# EAGLE design batstack_mic (EAGLE 5.10)
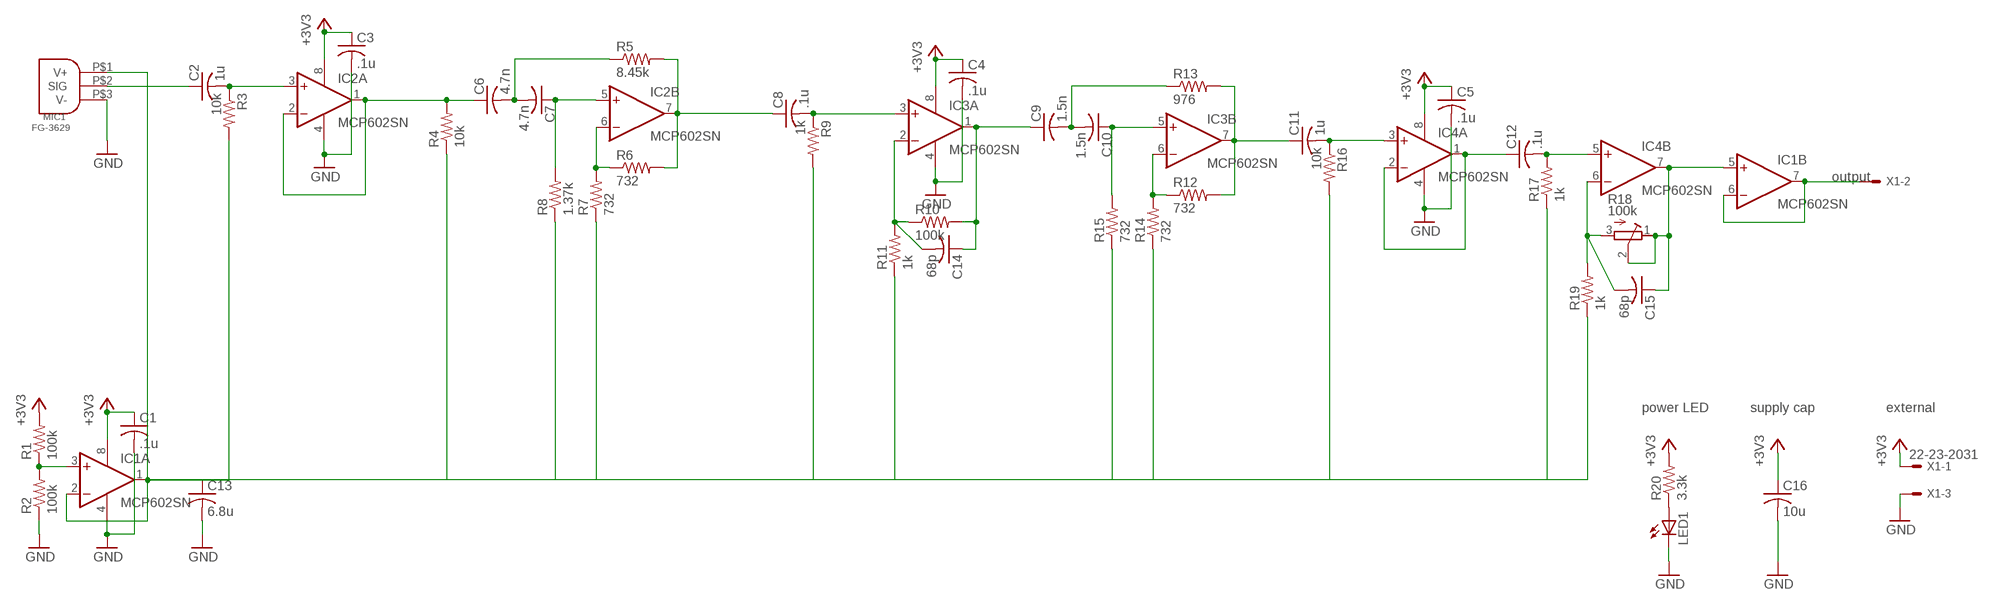
[diagram p0: schematic, sheet 1]

## Parts
C1  .1u  C-USC0603  [C0603]
C2  1u  C-USC0603  [C0603]
C3  .1u  C-USC0603  [C0603]
C4  .1u  C-USC0603  [C0603]
C5  .1u  C-USC0603  [C0603]
C6  4.7n  C-USC0603  [C0603]
C7  4.7n  C-USC0603  [C0603]
C8  .1u  C-USC0603  [C0603]
C9  1.5n  C-USC0603  [C0603]
C10  1.5n  C-USC0603  [C0603]
C11  1u  C-USC0603  [C0603]
C12  .1u  C-USC0603  [C0603]
C13  6.8u  C-USC0805  [C0805]
C14  68p  C-USC0603  [C0603]
C15  68p  C-USC0603  [C0603]
C16  10u  C-USC0805  [C0805]
IC1  MCP602SN  [SO08]
IC2  MCP602SN  [SO08]
IC3  MCP602SN  [SO08]
IC4  MCP602SN  [SO08]
LED1  LEDCHIP-LED0603  [CHIP-LED0603]
MIC1  FG-3629  [FG-3329]
R1  100k  R-US_R0603  [R0603]
R2  100k  R-US_R0603  [R0603]
R3  10k  R-US_R0603  [R0603]
R4  10k  R-US_R0603  [R0603]
R5  8.45k  R-US_R0603  [R0603]
R6  732  R-US_R0603  [R0603]
R7  732  R-US_R0603  [R0603]
R8  1.37k  R-US_R0603  [R0603]
R9  1k  R-US_R0603  [R0603]
R10  100k  R-US_R0603  [R0603]
R11  1k  R-US_R0603  [R0603]
R12  732  R-US_R0603  [R0603]
R13  976  R-US_R0603  [R0603]
R14  732  R-US_R0603  [R0603]
R15  732  R-US_R0603  [R0603]
R16  10k  R-US_R0603  [R0603]
R17  1k  R-US_R0603  [R0603]
R18  100k  R-TRIMMT93YB  [RTRIMT93YB]
R19  1k  R-US_R0603  [R0603]
R20  3.3k  R-US_R0603  [R0603]
X1  22-23-2031  [22-23-2031]

## Nets
+3V3: C1.1 C3.1 C4.1 C5.1 C16.1 IC1.8(P:V+) IC2.8(P:V+) IC3.8(P:V+) IC4.8(P:V+) R1.2 R20.2 X1.1
GND: C1.2 C3.2 C4.2 C5.2 C13.2 C16.2 IC1.4(P:V-) IC2.4(P:V-) IC3.4(P:V-) IC4.4(P:V-) LED1.C MIC1.P$3(V-) R2.1 X1.3
N$1: C2.1 MIC1.P$2(SIG)
N$2: IC1.3(A:+IN) R1.1 R2.2
N$3: C2.2 IC2.3(A:+IN) R3.1
N$4: C6.2 C7.2 R5.1
N$5: C8.2 IC3.3(A:+IN) R9.1
N$6: C6.1 IC2.1(A:OUT) IC2.2(A:-IN) R4.2
N$7: IC2.6(B:-IN) R6.1 R7.2
N$8: C7.1 IC2.5(B:+IN) R8.2
N$9: C8.1 IC2.7(B:OUT) R5.2 R6.2
N$10: C9.1 C14.1 IC3.1(A:OUT) R10.2
N$11: C14.2 IC3.2(A:-IN) R10.1 R11.2
N$12: C9.2 C10.2 R13.1
N$13: C10.1 IC3.5(B:+IN) R15.2
N$14: C11.1 IC3.7(B:OUT) R12.2 R13.2
N$15: IC3.6(B:-IN) R12.1 R14.2
N$16: C11.2 IC4.3(A:+IN) R16.1
N$17: C12.1 IC4.1(A:OUT) IC4.2(A:-IN)
N$18: C12.2 IC4.5(B:+IN) R17.2
N$20: IC1.6(B:-IN) IC1.7(B:OUT) X1.2
N$21: C15.2 IC4.6(B:-IN) R18.3(E) R19.2
N$22: LED1.A R20.1
N$23: C15.1 IC1.5(B:+IN) IC4.7(B:OUT) R18.1(A) R18.2(S)
V_OFFSET: C13.1 IC1.1(A:OUT) IC1.2(A:-IN) MIC1.P$1(V+) R3.2 R4.1 R7.1 R8.1 R9.2 R11.1 R14.1 R15.1 R16.2 R17.1 R19.1

## Notes on the sheet
- output
- power LED | supply cap | external

## Library data of the parts
C1-C16 = rcl:C-US: CAPACITOR, American symbol
IC1-IC4 = linear:MCP602: Single Op Amp 2.7V to 6.0V Single Supply CMOS Source: http://ww1.microchip.com/downloads/en/DeviceDoc/21314g.pdf
LED1 = led:LED: LED OSRAM: - CHIPLED LG R971, LG N971, LY N971, LG Q971, LY Q971, LO R971, LY R971 LH N974, LH R974 LS Q976, LO Q976, LY Q976 LO Q996 - Hyper CHIPLED LW Q18S LB Q993, LB Q99A, LB R99A - SideLED LS A670, LO A670, LY A670, LG A670, LP A670 LB A673, LV A673, LT A673, LW A673 LH A674 LY A675 LS A676, LA A676, LO A676, LY A676, LW A676 LS A679, LY A679, LG A679 - Hyper Micro SIDELED® LS Y876, LA Y876, LO Y876, LY Y876 LT Y87S - SmartLED LW L88C, LW L88S LB L89C, LB L89S, LG L890 LS L89K, LO L89K, LY L89K LS L896, LA L896, LO L896, LY L896 - TOPLED LS T670, LO T670, LY T670, LG T670, LP T670 LSG T670, LSP T670, LSY T670, LOP T670, LYG T670 LG T671, LOG T671, LSG T671 LB T673, LV T673, LT T673, LW T673 LH T674 LS T676, LA T676, LO T676, LY T676, LB T676, LH T676, LSB T676, LW T676 LB T67C, LV T67C, LT T67C, LS T67K, LO T67K, LY T67K, LW E67C LS E67B, LA E67B, LO E67B, LY E67B, LB E67C, LV E67C, LT E67C LW T67C LS T679, LY T679, LG T679 LS T770, LO T770, LY T770, LG T770, LP T770 LB T773, LV T773, LT T773, LW T773 LH T774 LS E675, LA E675, LY E675, LS T675 LS T776, LA T776, LO T776, LY T776, LB T776 LHGB T686 LT T68C, LB T68C - Hyper Mini TOPLED® LB M676 - Mini TOPLED Santana® LG M470 LS M47K, LO M47K, LY M47K Source: http://www.osram.convergy.de LUXEON: - LUMILED® LXK2-PW12-R00, LXK2-PW12-S00, LXK2-PW14-U00, LXK2-PW14-V00 LXK2-PM12-R00, LXK2-PM12-S00, LXK2-PM14-U00 LXK2-PE12-Q00, LXK2-PE12-R00, LXK2-PE12-S00, LXK2-PE14-T00, LXK2-PE14-U00 LXK2-PB12-K00, LXK2-PB12-L00, LXK2-PB12-M00, LXK2-PB14-N00, LXK2-PB14-P00, LXK2-PB14-Q00 LXK2-PR12-L00, LXK2-PR12-M00, LXK2-PR14-Q00, LXK2-PR14-R00 LXK2-PD12-Q00, LXK2-PD12-R00, LXK2-PD12-S00 LXK2-PH12-R00, LXK2-PH12-S00 LXK2-PL12-P00, LXK2-PL12-Q00, LXK2-PL12-R00 Source: www.luxeon.com KINGBRIGHT: KA-3528ASYC Source: www.kingbright.com
MIC1 = scott_eagle:FG-: Knowles FG-3329 or FG-3629 electret microphone
R1-R17 R19 R20 = rcl:R-US_: RESISTOR, American symbol
R18 = rcl:R-TRIMM: Trimm resistor
X1 = con-molex:22-23-2031: .100" (2.54mm) Center Header - 3 Pin

## Board
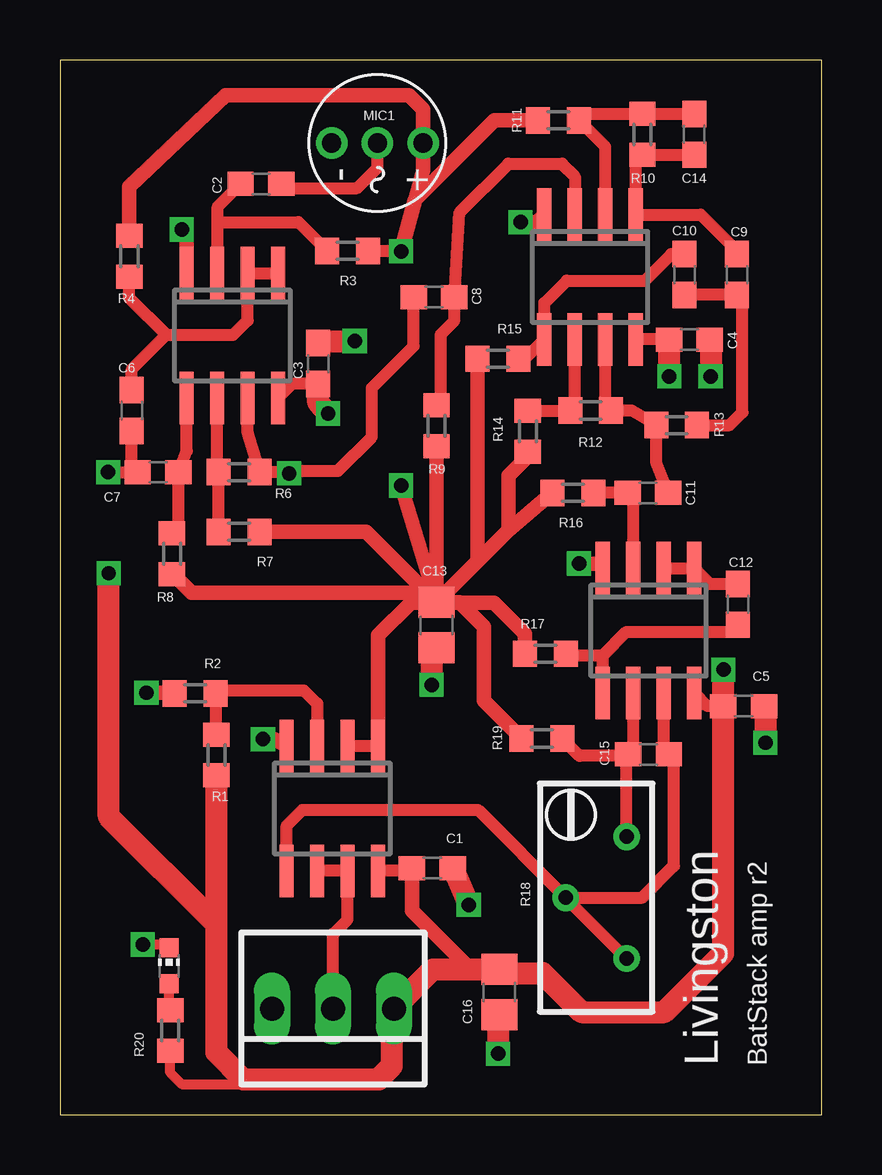
[diagram p1: board, top side]
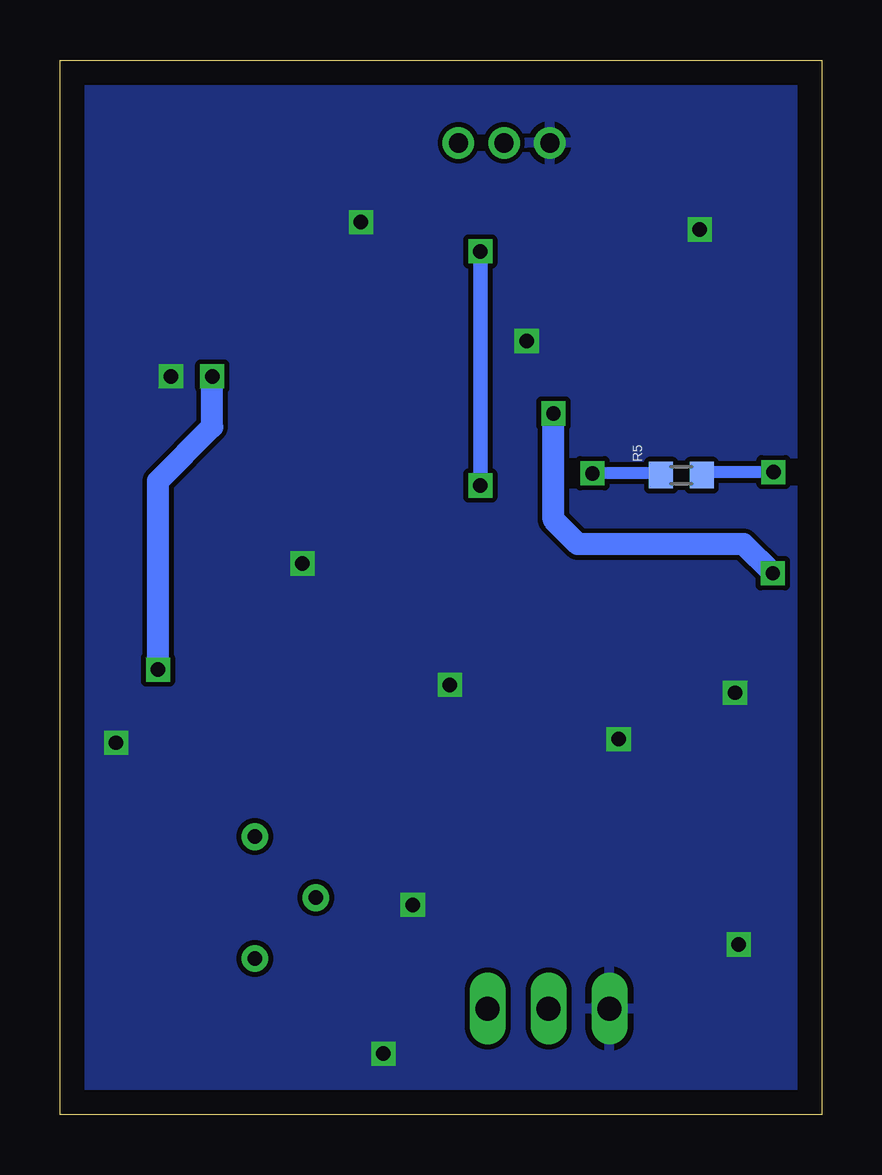
[diagram p2: board, bottom side, seen from below]

Size 31.75 x 43.94 mm. Coordinates in mm from the lower left corner, seen from the top.
Outline: 0,0 31.75,0 31.75,43.94 0,43.94 0,0
Copper layers (1*16): Top 0.035mm / dielectric 1.5mm / Bottom 0.035mm
Design rules "batstack_mic": minimum track width 10mil, minimum drill 23.5mil, track to track 8mil, track to pad 8mil, pad to pad 8mil, via to via 8mil, smd to smd 7mil, copper to edge 40mil, drill to drill 8mil, minimum pad ring 10mil, minimum via ring 8mil, stop-mask expansion 4mil, vias tented up to drill 0mil, thermal gap 10mil

### Footprints (pad centres in the part's own frame; a part is rotated, then mirrored left to right if it is on the bottom)
C0603 = smd 1.1 x 1: 1 -0.85,0; 2 0.85,0
C0805 = smd 1.3 x 1.5: 1 -0.95,0; 2 0.95,0
SO08 = smd 0.6 x 2.2: 1 -1.905,-2.6; 2 -0.635,-2.6; 3 0.635,-2.6; 4 1.905,-2.6; 5 1.905,2.6; 6 0.635,2.6; 7 -0.635,2.6; 8 -1.905,2.6
CHIP-LED0603 = smd 0.8 x 0.8: A 0,-0.75; C 0,0.75
FG-3329 = drill 0.8 round: P$1 0,1.905; P$2 0,0; P$3 0,-1.905
R0603 = smd 1 x 1.1: 1 -0.85,0; 2 0.85,0
RTRIMT93YB = drill 0.61 round: 1 1.27,-2.54; 2 -1.27,0; 3 1.27,2.54
22-23-2031 = drill 1 long: 1 -2.54,0; 2 0,0; 3 2.54,0

### Placement (x,y rotation side)
C1  15.52,10.26 0 top
C2  8.38,38.79 180 top
C3  10.77,31.29 90 top
C4  26.24,32.28 0 top
C5  28.5,17.02 0 top
C6  3,29.34 270 top
C7  4.09,26.77 180 top
C8  15.6,34.06 0 top
C9  28.22,35 270 top
C10  26.04,35 270 top
C11  24.51,25.91 180 top
C12  28.27,21.26 270 top
C13  15.7,20.4 270 top
C14  26.44,40.84 90 top
C15  24.54,15.01 180 top
C16  18.31,5.11 270 top
IC1  11.35,12.75 180 top
IC2  7.19,32.46 180 top
IC3  22.1,34.9 180 top
IC4  24.54,20.17 180 top
LED1  4.55,6.2 0 top
MIC1  13.23,40.49 270 top
R1  6.53,14.99 270 top
R2  5.64,17.55 0 top
R3  11.99,35.99 0 top
R4  2.9,35.76 270 top
R5  5.84,26.64 180 bottom
R6  7.47,26.77 0 top
R7  7.47,24.28 180 top
R8  4.67,23.37 90 top
R9  15.7,28.7 270 top
R10  24.28,40.84 270 top
R11  20.78,41.43 0 top
R12  22.12,29.34 0 top
R13  25.7,28.73 180 top
R14  19.51,28.47 90 top
R15  18.26,31.5 0 top
R16  21.39,25.91 180 top
R17  20.24,19.2 0 top
R18  22.35,9.04 0 top
R19  20.09,15.67 0 top
R20  4.6,3.51 270 top
X1  11.38,4.42 180 top

### Tracks (layer width: path | path; a pad name or v marks a point on that pad's centre or on a via)
+3V3  (via drill 0.6)
  Top 0.406: R20.2 4.6,1.75 5.08,1.27 7.44,1.27 7.64,1.47
  Top 0.508: IC1.8 14.56,10.15 C1.1 | C16.1 17.11,6.05 | C3.1 9.68,30.44 IC2.8 | IC3.8 25.37,32.3 C4.1 | C5.1 26.99,17.02 IC4.8
  Top 0.61: 17.11,6.05 14.67,8.49 C1.1 | C4.1 | C16.1 18.48,5.89
  Top 0.914: v25.4,30.76 C4.1 | 18.48,5.89 20.12,5.89 21.74,4.27 25.2,4.27 27.65,6.72 C5.1 v27.65,18.53 v27.66,18.54 | 6.53,7.92 R1.2 | v2.03,22.55 2.03,12.42 6.53,7.92 | v11.18,29.21 10.77,29.67 C3.1 | C16.1 15.55,6.05 X1.1 13.84,4.34 13.84,2.03 13.28,1.47 7.64,1.47 6.53,2.59 6.53,7.92
  Bottom 0.914: v2.03,22.55 3.25,23.77 10.16,23.77 11.18,24.79 v11.18,29.21 | v27.66,18.54 27.66,26.39 25.4,28.65 v25.4,30.76
GND  (via drill 0.6, 0.6 pad 0.25)
  Top 0.406: v3.45,7.09 4.41,7.09 LED1.C
  Top 0.61: v8.46,15.65 8.95,15.65 IC1.4 | IC2.4 5.28,36.58 v5.08,36.88 | C5.2 29.41,16.95 | v21.64,22.96 22.44,22.96 IC4.4 | v3.61,17.58 4.76,17.58 R2.1 | v19.2,37.19 19.88,37.19 IC3.4
  Top 0.914: v17.04,8.74 16.43,10.2 C1.2 | 18.41,4.06 arc-90 C16.2 18.26,4.11 v18.26,2.54 | C3.2 10.86,32.23 v12.29,32.23 | v27.13,30.76 27.13,32.24 C4.2 | 29.41,16.95 v29.41,15.49 | v15.49,17.91 15.49,19.24 C13.2
  pour Bottom: 0.64,43.31 31.11,43.31 31.11,0.64 0.64,0.64
N$1
  Top 0.508: MIC1.P$2 13.23,39.45 12.39,38.61 9.41,38.61 C2.1
N$2
  Top 0.508: IC1.3 10.72,17.12 10.16,17.68 6.62,17.68 R2.2 6.49,15.88 R1.1
N$3
  Top 0.508: IC2.3 6.58,35.09 6.58,37.19 | C2.2 6.58,37.83 6.58,37.19 | R3.1 9.95,37.19 6.58,37.19
N$4  (via drill 0.6)
  Top 0.508: 3,27.01 C7.2 | 3,27.01 C6.2 | 3,27.01 2.75,26.77 v2.01,26.77
  Bottom 0.508: R5.1 4.87,26.77 v2.01,26.77
N$5
  Top 0.508: R9.1 15.88,29.73 15.88,32.51 16.45,33.08 C8.2 16.66,37.59 18.69,39.62 20.93,39.62 21.46,39.09 IC3.3
N$6
  Top 0.508: IC2.1 IC2.2 7.82,33.1 7.21,32.49 4.42,32.49 | C6.1 3,31.06 4.42,32.49 | 4.42,32.49 2.9,34.01 R4.2
N$7
  Top 0.508: IC2.6 6.55,26.96 R6.1 R7.2
N$8
  Top 0.508: IC2.5 5.28,27.65 C7.1 4.94,24.48 R8.2
N$9  (via drill 0.6)
  Top 0.508: IC2.7 7.82,28.4 R6.2 9.5,26.77 v9.55,26.72 | v9.55,26.72 9.58,26.75 | C8.1 14.75,32.02 13.01,30.28 13.01,28.25 11.58,26.82 9.65,26.82 v9.55,26.72
  Bottom 0.508: R5.2 6.77,26.72 v9.55,26.72
N$10
  Top 0.508: C14.1 R10.2 24,39.71 IC3.1 26.71,37.5 28.22,35.99 C9.1
N$11
  Top 0.508: C14.2 R10.1 21.89,41.69 R11.2 22.73,40.32 IC3.2
N$12
  Top 0.508: C10.2 C9.2 28.45,33.92 28.45,29.26 27.91,28.73 R13.1
N$13
  Top 0.508: C10.1 25.49,35.85 24.38,34.75 21.13,34.75 20.19,33.81 IC3.5 19.39,31.5 R15.2
N$14
  Top 0.508: IC3.7 22.73,29.58 R12.2 23.84,29.34 R13.2 24.86,27.16 C11.1
N$15
  Top 0.508: IC3.6 21.46,29.38 R12.1 19.52,29.34 R14.2
N$16
  Top 0.508: R16.1 C11.2 23.9,25.67 IC4.3
N$17
  Top 0.508: IC4.2 IC4.1 27.1,22.11 C12.1
N$18
  Top 0.508: C12.2 27.98,20.12 23.62,20.12 22.63,19.13 | IC4.5 22.63,19.13 | R17.2 21.17,19.13 22.63,19.13
N$20
  Top 0.508: IC1.6 IC1.7 11.99,8.13 11.38,7.52 X1.2
N$21
  Top 0.508: IC4.6 23.9,15.43 C15.2 23.62,14.95 | R18.3 23.62,14.95 | 23.62,14.95 21.67,14.95 R19.2
N$22
  Top 0.406: LED1.A 4.55,4.41 R20.1
N$23
  Top 0.508: IC1.5 9.45,12.04 10.11,12.7 17.42,12.7 R18.2 | IC4.7 25.17,15.43 C15.1 25.6,14.79 25.6,10.36 24.28,9.04 R18.2 | R18.2 R18.1
V_OFFSET  (via drill 0.6)
  Top 0.508: IC1.1 IC1.2 | R3.2 12.86,35.97 v14.22,35.97
  Top 0.61: R4.1 2.9,38.66 6.91,42.47 14.55,42.47 15.14,41.88 MIC1.P$1 15.14,39.32 14.81,38.12 | IC1.1 13.26,19.96 14.63,21.34 15.69,21.34 C13.1 | C13.1 12.76,24.28 R7.1 | C13.1 15.3,21.74 5.49,21.74 4.71,22.52 R8.1 | C13.1 R9.2 | C13.1 17.41,23.06 R15.1 | C13.1 18.69,24.34 | 18.69,24.34 18.69,26.62 19.51,27.43 R14.1 | 18.69,24.34 R16.2 | R19.1 17.68,17.23 17.68,20.32 16.65,21.35 C13.1 | R17.1 19.39,20.03 18.09,21.34 15.71,21.34 C13.1 | C13.1 v14.22,26.21 | v14.22,35.97 14.81,38.12 | R11.1 18.12,41.43 14.81,38.12
  Bottom 0.61: v14.22,26.21 v14.22,35.97

### Text on the board
tPlace: Livingston | BatStack amp r2